# EAGLE design RPi-HAT_BUS-Controller_V0.7 (EAGLE 6.5.0)
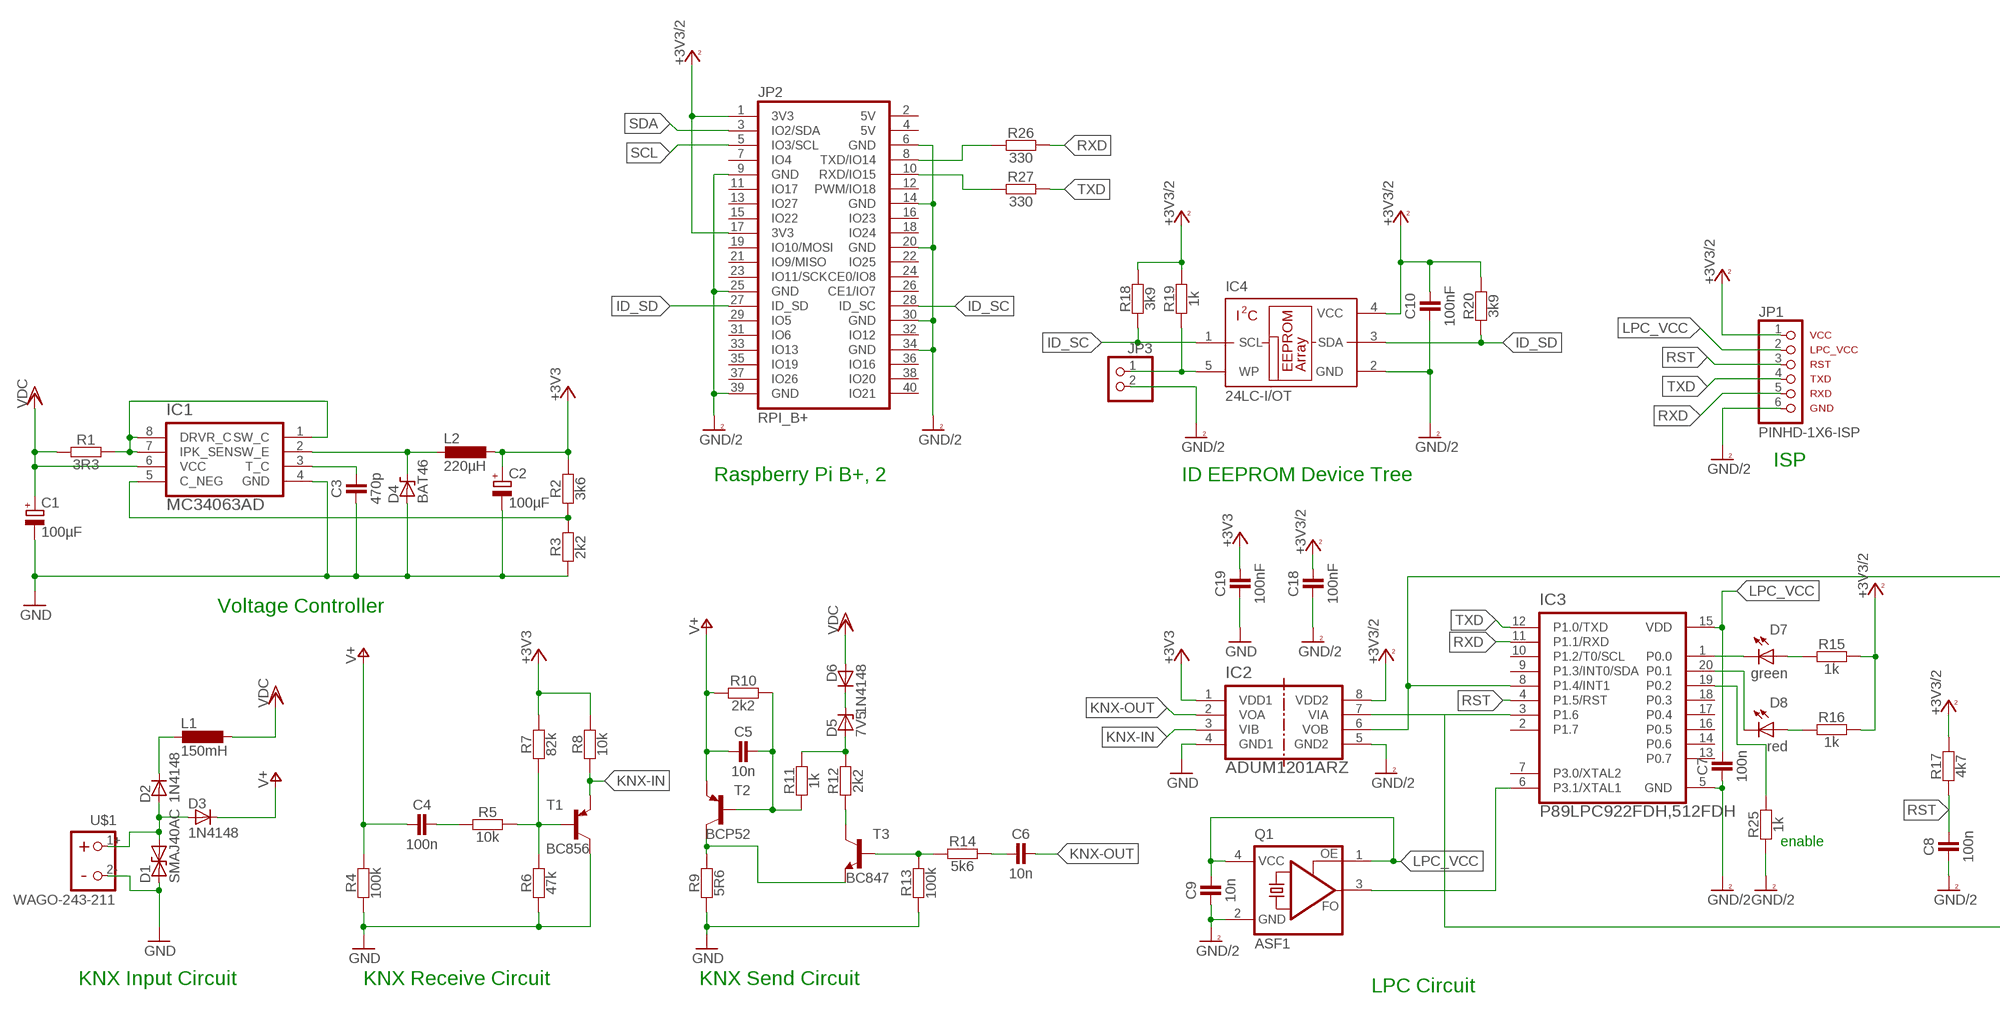
[diagram p0: schematic, sheet 1, part 1 of 2]
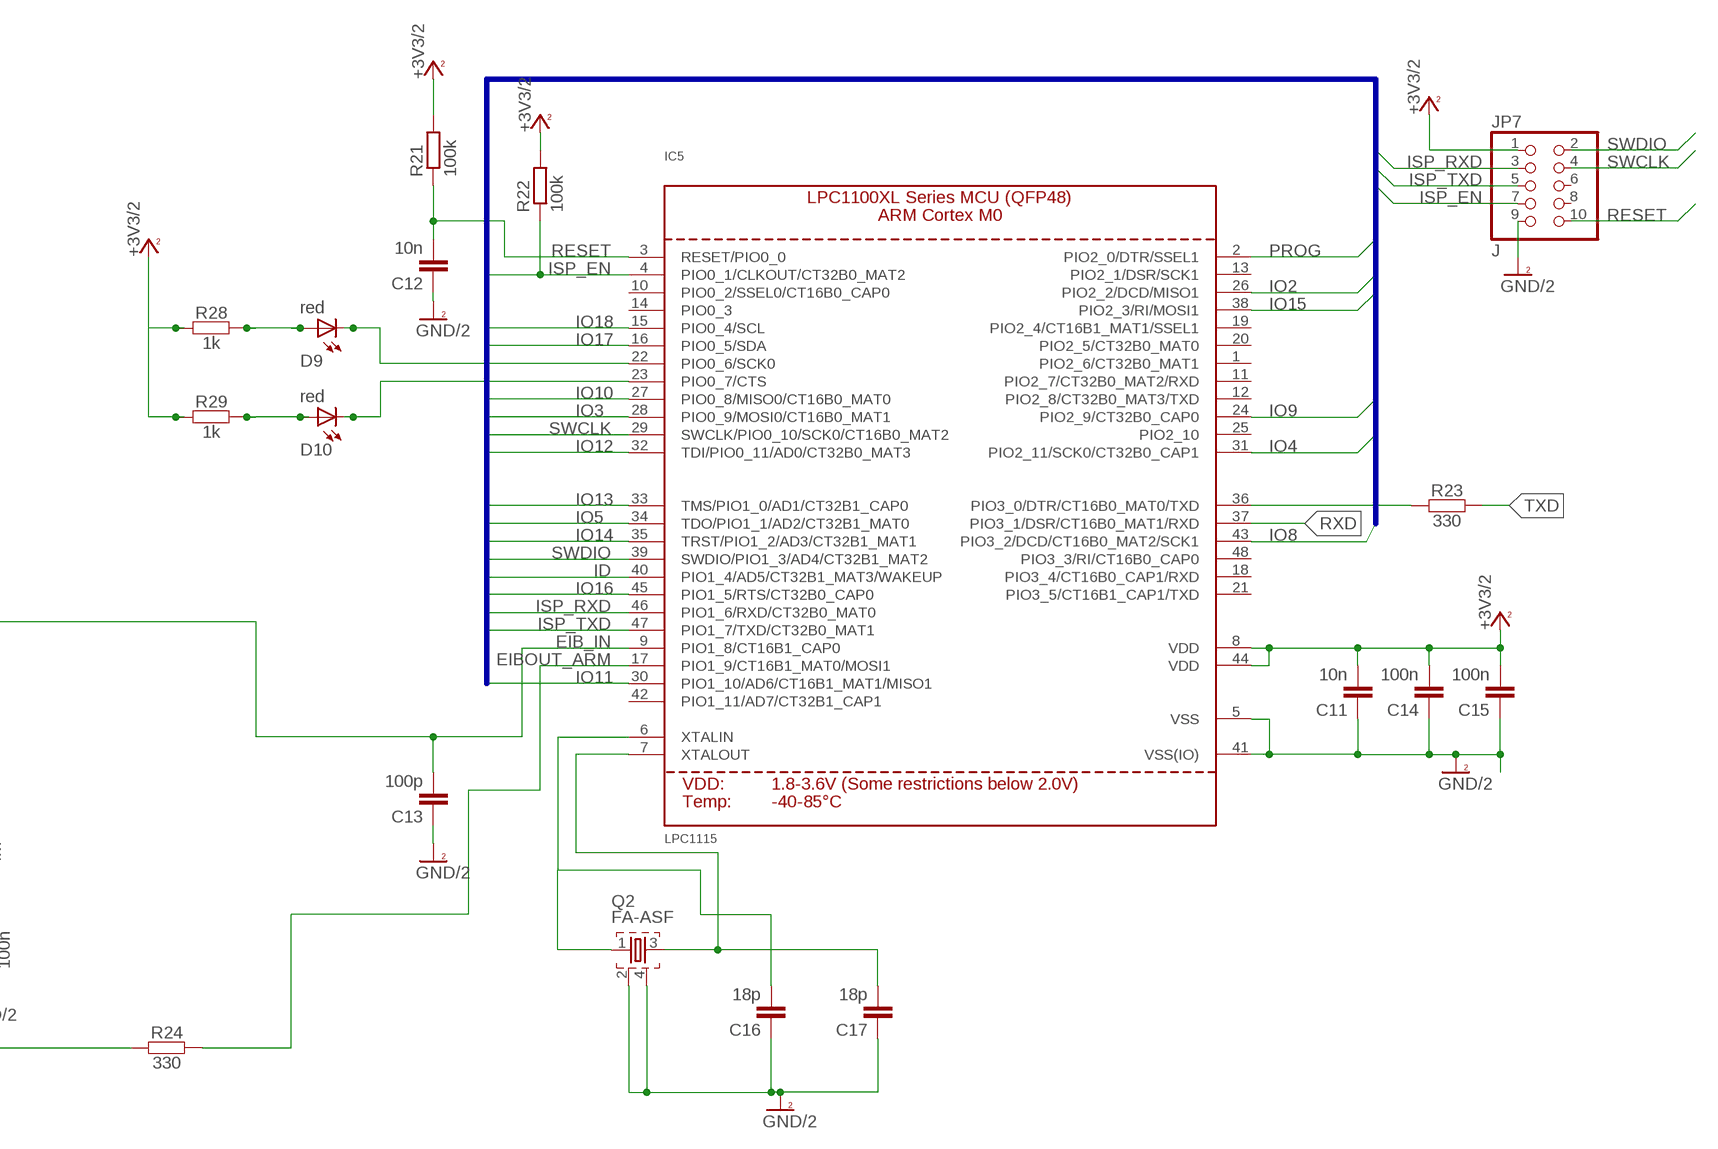
[diagram p1: schematic, sheet 1, part 2 of 2]

## Parts
C1  100µF  100µF,35V  [PANASONIC_D]
C2  100µF  100µF,6.3V  [PANASONIC_C]
C3  470p  CAPACITORC1206  [R1206]
C4  100n  CAPACITORC1206  [R1206]
C5  10n  CAPACITORC1206  [R1206]
C6  10n  CAPACITORC1206  [R1206]
C7  100n  CAPACITORC1206  [R1206]
C8  100n  CAPACITORC1206  [R1206]
C9  10n  CAPACITORC1206  [R1206]
C10  100nF  CAPACITORC1206  [R1206]
C11  10n  C-EUC1206  [C1206]
C12  10n  C-EUC1206  [C1206]
C13  100p  C-EUC1206  [C1206]
C14  100n  C-EUC1206  [C1206]
C15  100n  C-EUC1206  [C1206]
C16  18p  C-EUC1206  [C1206]
C17  18p  C-EUC1206  [C1206]
C18  100nF  CAPACITORC1206  [R1206]
C19  100nF  CAPACITORC1206  [R1206]
D1  SMAJ40AC  [DO-214AC]
D2  1N4148  1N4148MINIMELF  [MINIMELF]
D3  1N4148  1N4148MINIMELF  [MINIMELF]
D4  BAT46  [MINIMELF]
D5  7V5  Z-DIODE  [MINIMELF]
D6  1N4148  1N4148MINIMELF  [MINIMELF]
D7  green  LED1206  [CHIPLED_1206]
D8  red  LED1206  [CHIPLED_1206]
D9  red  LED1206  [CHIPLED_1206]
D10  red  LED1206  [CHIPLED_1206]
IC1  MC34063AD  [SOIC127P600X175-8N]
IC2  ADUM1201ARZ  [SOIC127P600X175-8N]
IC3  P89LPC922FDH,512FDH  [SOP65P640X110-20N]
IC4  24LC-I/OT  [SOT23-5]
IC5  LPC1115  LPC1113/4/5_QFP48_XLSERIES  [LQFP48]
JP1  PINHD-1X6-ISP  [1X06]
JP2  RPI_B+  [RPI-B+HAT]
JP3  PINHD-1X2  [1X02]
JP7  J  PINHD-2X05_2.00  [2X05M]
L1  150mH  150MH-L11PL1  [11P-L1]
L2  220µH  220µH-SMCC11.43  [2200-11.43]
Q1  ASF1  [ASF]
Q2  FA-ASF  [ASF]
R1  3R3  RESISTORR1206  [R1206]
R2  3k6  RESISTORR1206  [R1206]
R3  2k2  RESISTORR1206  [R1206]
R4  100k  RESISTORR1206  [R1206]
R5  10k  RESISTORR1206  [R1206]
R6  47k  RESISTORR1206  [R1206]
R7  82k  RESISTORR1206  [R1206]
R8  10k  RESISTORR1206  [R1206]
R9  5R6  RESISTORR1206  [R1206]
R10  2k2  RESISTORR1206  [R1206]
R11  1k  RESISTORR1206  [R1206]
R12  2k2  RESISTORR1206  [R1206]
R13  100k  RESISTORR1206  [R1206]
R14  5k6  RESISTORR1206  [R1206]
R15  1k  RESISTORR1206  [R1206]
R16  1k  RESISTORR1206  [R1206]
R17  4k7  RESISTORR1206  [R1206]
R18  3k9  RESISTORR1206  [R1206]
R19  1k  RESISTORR1206  [R1206]
R20  3k9  RESISTORR1206  [R1206]
R21  100k  R-EU_R1206  [R1206]
R22  100k  R-EU_R1206  [R1206]
R23  330  RESISTORR1206  [R1206]
R24  330  RESISTORR1206  [R1206]
R25  1k  RESISTORR1206  [R1206]
R26  330  RESISTORR1206  [R1206]
R27  330  RESISTORR1206  [R1206]
R28  1k  RESISTORR1206  [R1206]
R29  1k  RESISTORR1206  [R1206]
T1  BC856  PNPBC856  [SOT23]
T2  BCP52  PNPBCP52  [SOT223]
T3  BC847  NPN-BC847  [SOT23]
U$1  WAGO-243-211  [WAGO-243-211]

## Nets
+3V3: C2.+ C19.2 IC2.1(VDD1) L2.1 R2.2 R7.2 R8.2
+3V3/2: C10.2 C11.2 C14.2 C15.2 C18.2 IC2.8(VDD2) IC4.4(VCC) IC5.8(VDD) IC5.44(VDD) JP1.1 JP2.1(3V3) JP2.17(3V3) JP7.1 R15.2 R16.2 R17.2 R18.2 R19.2 R20.2 R21.2 R22.2 R28.1 R29.1
EIB_IN: C13.2 IC2.6(VOB) IC3.8(P1.4/INT1) IC5.9(PIO1_8/CT16B1_CAP0)
EIB_OUT: IC2.7(VIA) IC3.3(P1.6) R24.1
EIBOUT_ARM: IC5.17(PIO1_9/CT16B1_MAT0/MOSI1) R24.2
GND: C1.- C2.- C3.1 C19.1 D1.A D4.A IC1.4(GND) IC2.4(GND1) R3.1 R4.1 R6.1 R9.1 R13.1 T1.3(C) U$1.2-
GND/2: C7.1 C8.1 C9.1 C10.1 C11.1 C12.1 C13.1 C14.1 C15.1 C16.1 C17.1 C18.1 IC2.5(GND2) IC3.5(GND) IC4.2(GND) IC5.5(VSS) IC5.41(VSS(IO)) JP1.6 JP2.6(GND) JP2.9(GND) JP2.14(GND) JP2.20(GND) JP2.25(GND) JP2.30(GND) JP2.34(GND) JP2.39(GND) JP3.2 JP7.9 Q1.2(GND) Q2.2 Q2.4 R25.1
ID: IC5.40(PIO1_4/AD5/CT32B1_MAT3/WAKEUP)
ID_SC: IC4.1(SCL) JP2.28(ID_SC) R18.1
ID_SD: IC4.3(SDA) JP2.27(ID_SD) R20.1
IO2: IC5.26(PIO2_2/DCD/MISO1)
IO3: IC5.28(PIO0_9/MOSI0/CT16B0_MAT1)
IO4: IC5.31(PIO2_11/SCK0/CT32B0_CAP1)
IO5: IC5.34(TDO/PIO1_1/AD2/CT32B1_MAT0)
IO8: IC5.43(PIO3_2/DCD/CT16B0_MAT2/SCK1)
IO9: IC5.24(PIO2_9/CT32B0_CAP0)
IO10: IC5.27(PIO0_8/MISO0/CT16B0_MAT0)
IO11: IC5.30(PIO1_10/AD6/CT16B1_MAT1/MISO1)
IO12: IC5.32(TDI/PIO0_11/AD0/CT32B0_MAT3)
IO13: IC5.33(TMS/PIO1_0/AD1/CT32B1_CAP0)
IO14: IC5.35(TRST/PIO1_2/AD3/CT32B1_MAT1)
IO15: IC5.38(PIO2_3/RI/MOSI1)
IO16: IC5.45(PIO1_5/RTS/CT32B0_CAP0)
IO17: IC5.16(PIO0_5/SDA)
IO18: IC5.15(PIO0_4/SCL)
ISP_EN: IC5.4(PIO0_1/CLKOUT/CT32B0_MAT2) JP7.7 R22.1
ISP_RXD: IC5.46(PIO1_6/RXD/CT32B0_MAT0) JP7.3
ISP_TXD: IC5.47(PIO1_7/TXD/CT32B0_MAT1) JP7.5
KNX-IN: IC2.3(VIB) R8.1 T1.2(E)
KNX-OUT: C6.2 IC2.2(VOA)
LPC_VCC: C7.2 C9.2 IC3.15(VDD) JP1.2 Q1.1(OE) Q1.4(VCC)
N$1: D1.C D2.A D3.A U$1.1+
N$2: C16.2 IC5.6(XTALIN) Q2.1
N$3: IC1.5(C_NEG) R2.1 R3.2
N$4: C4.2 R5.1
N$5: D2.C L1.2
N$6: R5.2 R6.2 R7.1 T1.1(B)
N$7: C17.2 IC5.7(XTALOUT) Q2.3
N$8: IC1.1(SW_C) IC1.7(IPK_SEN) IC1.8(DRVR_C) R1.2
N$9: D8.C IC3.20(P0.1)
N$10: C3.2 IC1.3(T_C)
N$11: D7.C IC3.1(P0.0)
N$12: IC4.5(WP) JP3.1 R19.1
N$13: D4.C IC1.2(SW_E) L2.2
N$14: IC3.19(P0.2) R25.2
N$15: D10.A R29.2
N$16: D9.A R28.2
N$17: JP2.8(TXD/IO14) R26.1
N$18: JP2.10(RXD/IO15) R27.1
N$19: D10.C IC5.23(PIO0_7/CTS)
N$20: D9.C IC5.22(PIO0_6/SCK0)
N$23: R9.2 T2.2(C) T2.4(C) T3.2(E)
N$24: C5.2 R10.2 R11.1 T2.1(B)
N$25: D5.A R11.2 R12.2
N$26: R12.1 T3.3(C)
N$28: R13.2 R14.1 T3.1(B)
N$29: C6.1 R14.2
N$31: D5.C D6.C
N$32: IC3.6(P3.1/XTAL1) Q1.3(FO)
N$35: D7.A R15.1
N$38: D8.A R16.1
PROG: IC5.2(PIO2_0/DTR/SSEL1)
RESET: C12.2 IC5.3(RESET/PIO0_0) JP7.10 R21.1
RST: C8.2 IC3.4(P1.5/RST) JP1.3 R17.1
RXD: IC3.11(P1.1/RXD) IC5.37(PIO3_1/DSR/CT16B0_MAT1/RXD) JP1.5 R26.2
SCL: JP2.5(IO3/SCL)
SDA: JP2.3(IO2/SDA)
SWCLK: IC5.29(SWCLK/PIO0_10/SCK0/CT16B0_MAT2) JP7.4
SWDIO: IC5.39(SWDIO/PIO1_3/AD4/CT32B1_MAT2) JP7.2
TXD: IC3.12(P1.0/TXD) JP1.4 R23.2 R27.2
TXD_ARM: IC5.36(PIO3_0/DTR/CT16B0_MAT0/TXD) R23.1
V+: C4.1 C5.1 D3.C R4.2 R10.1 T2.3(E)
VDD: C1.+ D6.A IC1.6(VCC) L1.1 R1.1 ; supply symbol labelled VDC
Unconnected: IC3.2(P1.7) IC3.7(P3.0/XTAL2) IC3.9(P1.3/INT0/SDA) IC3.10(P1.2/T0/SCL) IC3.13(P0.7) IC3.14(P0.6) IC3.16(P0.5) IC3.17(P0.4) IC3.18(P0.3) IC5.1(PIO2_6/CT32B0_MAT1) IC5.10(PIO0_2/SSEL0/CT16B0_CAP0) IC5.11(PIO2_7/CT32B0_MAT2/RXD) IC5.12(PIO2_8/CT32B0_MAT3/TXD) IC5.13(PIO2_1/DSR/SCK1) IC5.14(PIO0_3) IC5.18(PIO3_4/CT16B0_CAP1/RXD) IC5.19(PIO2_4/CT16B1_MAT1/SSEL1) IC5.20(PIO2_5/CT32B0_MAT0) IC5.21(PIO3_5/CT16B1_CAP1/TXD) IC5.25(PIO2_10) IC5.42(PIO1_11/AD7/CT32B1_CAP1) IC5.48(PIO3_3/RI/CT16B0_CAP0) JP2.2(5V) JP2.4(5V) JP2.7(IO4) JP2.11(IO17) JP2.12(PWM/IO18) JP2.13(IO27) JP2.15(IO22) JP2.16(IO23) JP2.18(IO24) JP2.19(IO10/MOSI) JP2.21(IO9/MISO) JP2.22(IO25) JP2.23(IO11/SCK) JP2.24(CE0/IO8) JP2.26(CE1/IO7) JP2.29(IO5) JP2.31(IO6) JP2.32(IO12) JP2.33(IO13) JP2.35(IO19) JP2.36(IO16) JP2.37(IO26) JP2.38(IO20) JP2.40(IO21) JP7.6 JP7.8

## Buses
IO[1..18],RESET,SWCLK,SWDIO,ISP_EN,PROG,ID,ISP_TXD,ISP_RXD

## Notes on the sheet
- ISP
- Raspberry Pi B+, 2 | ID EEPROM Device Tree
- Voltage Controller
- enable
- KNX Input Circuit | KNX Receive Circuit | KNX Send Circuit
- LPC Circuit

## Library data of the parts
C1 = RCL_for_Selfbus-Projects:100µF,35V: Polarized Capacitor 100µF, 35V
C2 = RCL_for_Selfbus-Projects:100µF,6.3V: Polarized Capacitor 100µF, 6.3V
C3-C10 C18 C19 = RCL_for_Selfbus-Projects:CAPACITOR: Capacitor
C11 C12 = rcl:C-EU: CAPACITOR, European symbol; REICHELT: X7R-G0805 10N
C13 = rcl:C-EU: CAPACITOR, European symbol; REICHELT: NPO-G0805 100P
C14 C15 = rcl:C-EU: CAPACITOR, European symbol; REICHELT: X7R-G0805 100N
C16 C17 = rcl:C-EU: CAPACITOR, European symbol
D1 = Diode:SMAJ40AC
D2 D3 = Diode:1N4148
D4 = Diode_for_Selfbus-Projects:BAT46: Schottky Diode
D5 = Diode_for_Selfbus-Projects:Z-DIODE: Z-Diode
D6 = Diode_for_Selfbus-Projects:1N4148: Diode
D7-D10 = Diode_for_Selfbus-Projects:LED: LED
IC1 = IC_for_Selfbus-Projects:MC34063A: DC/DC converter control circuit
IC2 = IC_for_Selfbus-Projects:ADUM1201ARZ: Dual-Channel Digital Isolators; MPN: ADUM1201ARZ; OC_FARNELL: 1078200; OC_NEWARK: 19M0753; PACKAGE: SOIC-8; SUPPLIER: Analog Devices
IC3 = IC_for_Selfbus-Projects:P89LPC922FDH,512: 8-bit microcontrollers with two-clock 80C51 core 2 kB/4 kB/8 kB 3 V low-power Flash with 256-byte data RAM; MPN: P89LPC922FDH,512; OC_FARNELL: 1895067; OC_NEWARK: 70R8570; PACKAGE: TSSOP-20; SUPPLIER: NXP
IC4 = IC_for_Selfbus-Projects:24LC*: Microchip I2C EEPROM 2 Kbit - 24LC02B - 24LC02BT-I/OTDKR-ND 32 Kbit- 24LC32A - 24LC32AT-I/OTDKR-ND; DIGIKEY: 24LC32AT-I/OTDKR-ND
IC5 = microbuilder:LPC1113/4/5_QFP48_XLSERIES: LPC1113/4/5 ARM Cortex M0 MCU (50MHz) - XL Series (FBD48/3x3) LPC1115FBD48/303: Max Frequency: 50MHz Flash: 64kB SRAM: 8kB ADC: 10-bit
JP1 = Connector_for_Selfbus-Projects:PINHD-1X6-ISP: PIN HEADER - ISP for Selfbus-Controller
JP2 = Connector_for_Selfbus-Projects:RPI_B+: RPi-B+ und RPi-B2 HAT
JP3 = Connector_for_Selfbus-Projects:PINHD-1X2: PIN HEADER
JP7 = pinhead-2:PINHD-2X05: PIN HEADER; REICHELT: MPE 150-3-010
L1 = RCL_for_Selfbus-Projects:150MH-L11P: Inductor 150mH
L2 = RCL_for_Selfbus-Projects:220µH-SMCC: Inductor 220µH
Q1 = IC_for_Selfbus-Projects:ASF*: CRYSTAL CLOCK OSCILLATORS 5.0 Vdc or 3.3 Vdc - LOW PROFILE ULTRA MINIATURE CERAMIC SURFACE MOUNT Source: http://www.abracon.com/Oscillators/asf1-L-L1.pdf; OC_FARNELL: unknown; OC_NEWARK: unknown
Q2 = crystal:FA-: MHz RANGE CRYSTAL UNIT Source: Epson Toyocom
R1-R20 R23-R29 = RCL_for_Selfbus-Projects:RESISTOR: Resistor
R21 R22 = rcl:R-EU_: RESISTOR, European symbol; REICHELT: SMD-0805 100K
T1 T2 = Transistor_for_Selfbus-Projects:PNP: PNP Transistor
T3 = Transistor_for_Selfbus-Projects:NPN: NPN Transistor
U$1 = Connector_for_Selfbus-Projects:WAGO-243-211: WAGO KNX-Busklemme

## Board
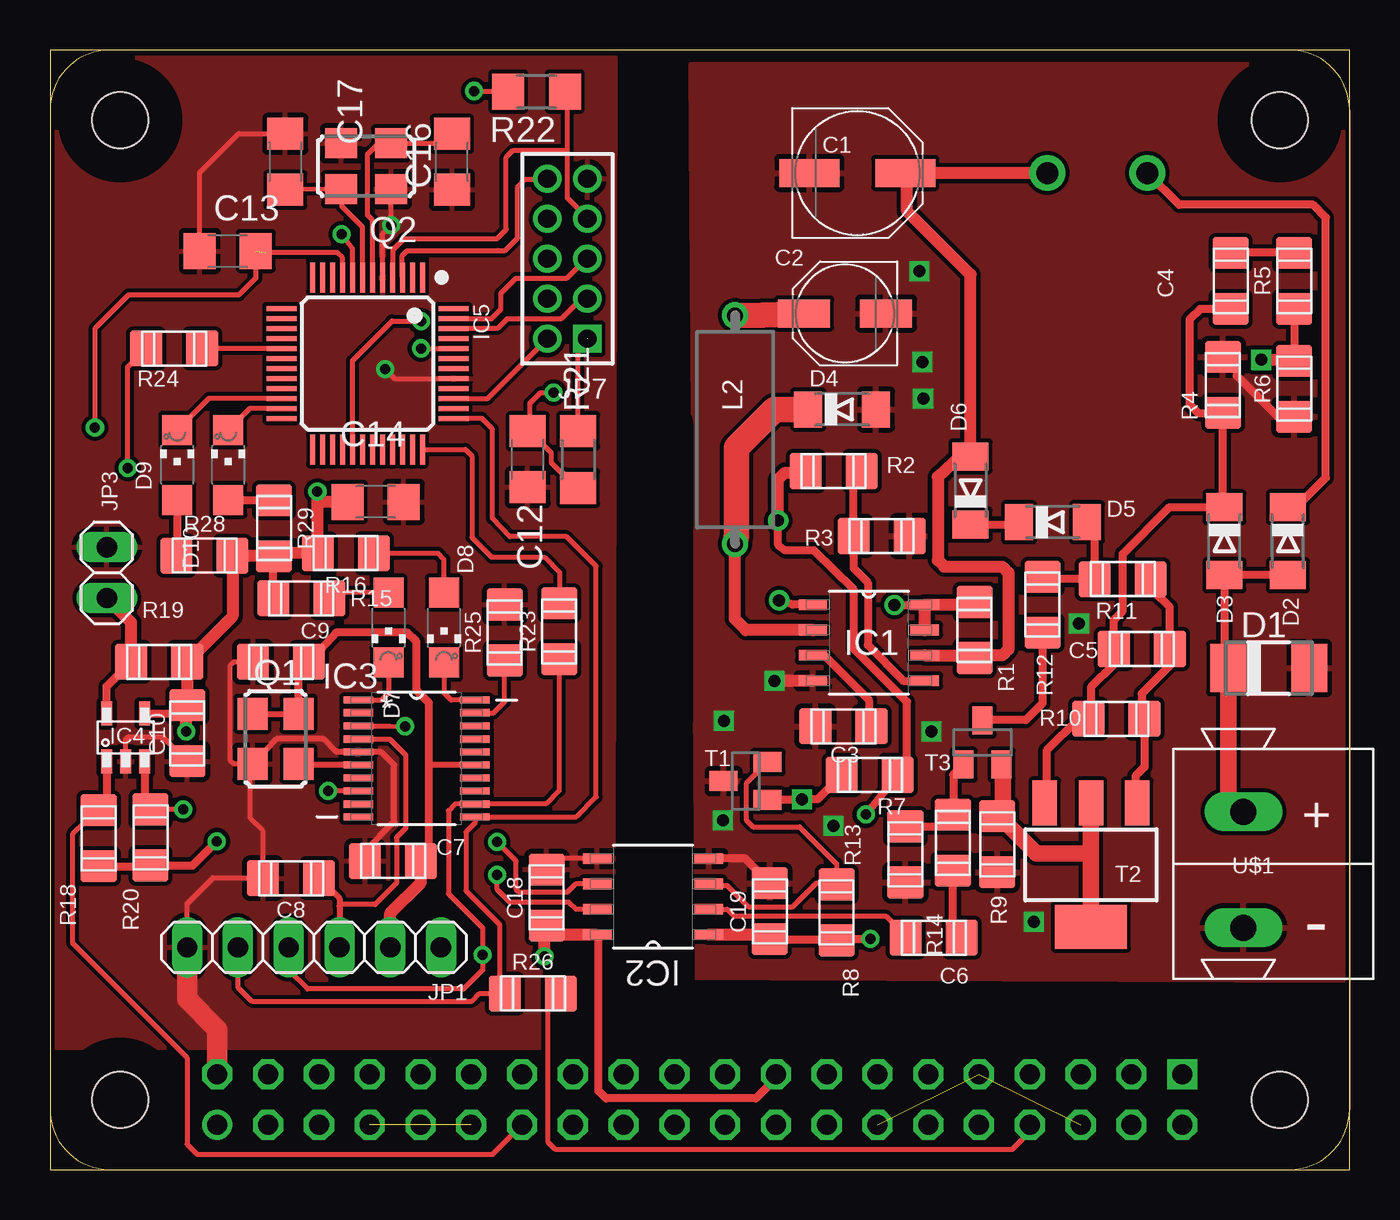
[diagram p2: board, top side]
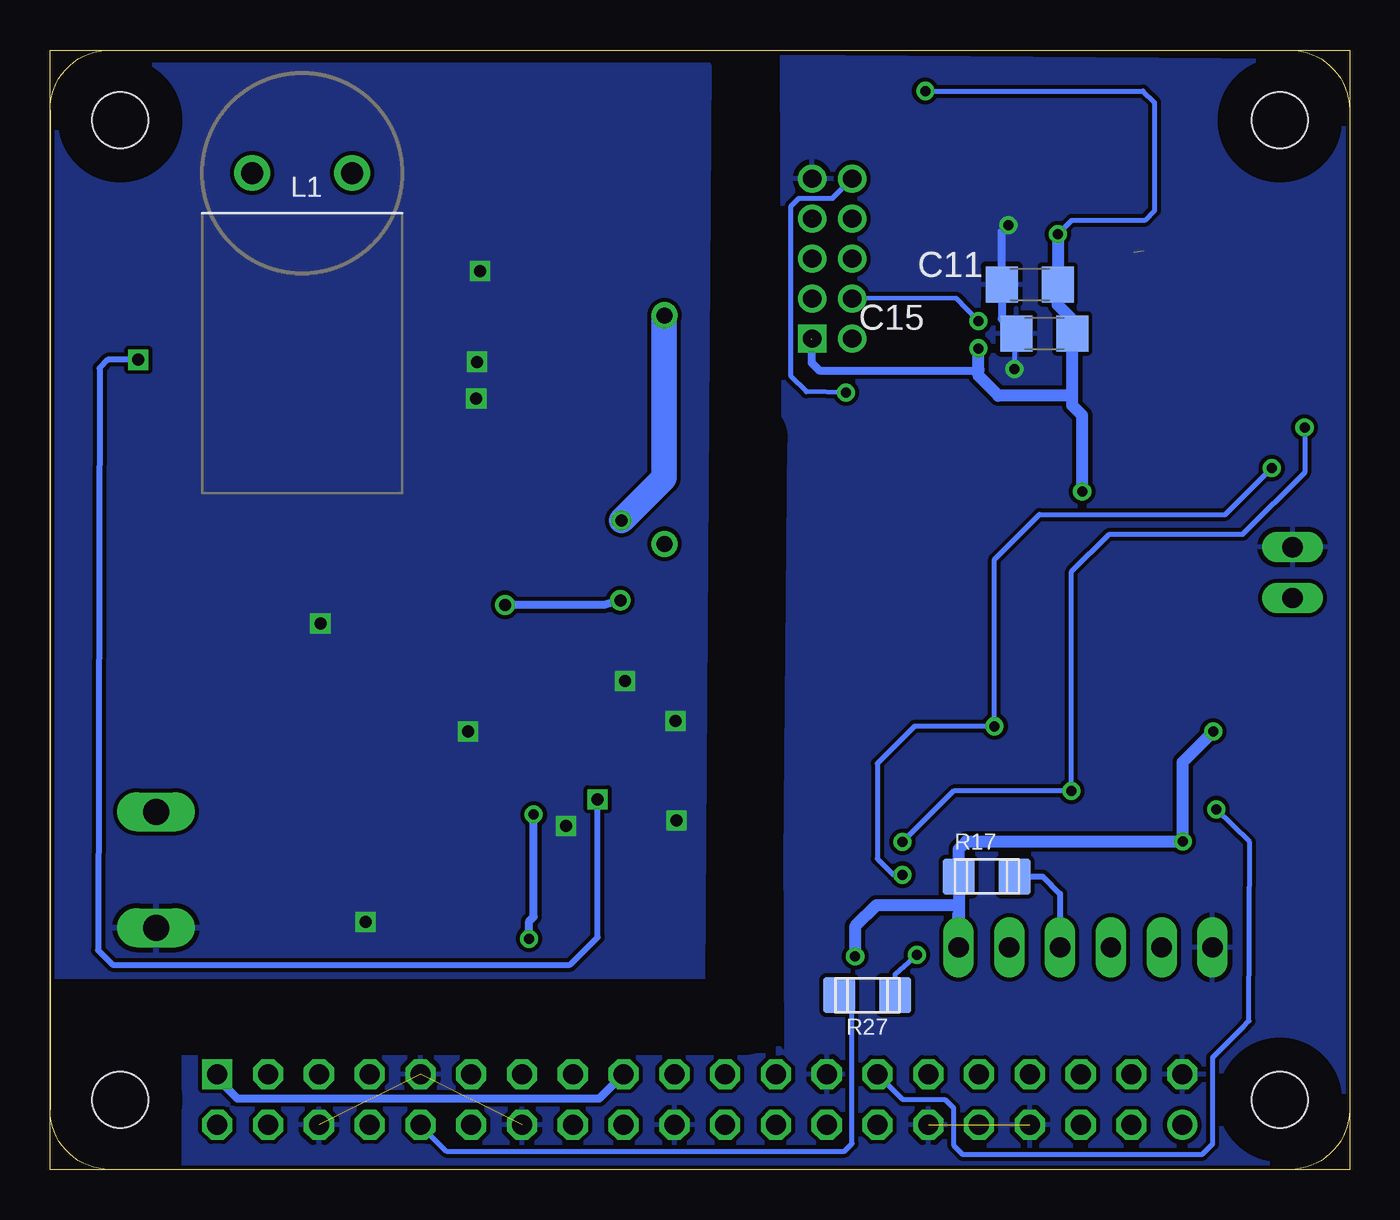
[diagram p3: board, bottom side, seen from below]

Size 65 x 56 mm. Coordinates in mm from the lower left corner, seen from the top.
Outline: 0,0 65,0 65,56 0,56 0,0
Copper layers (1*16): Top 0.035mm / dielectric 1.5mm / Bottom 0.035mm
Design rules "default *": minimum track width 8mil, minimum drill 0.3mm, track to track 8mil, track to pad 8mil, pad to pad 8mil, via to via 8mil, smd to smd 1mil, copper to edge 8mil, drill to drill 8mil, minimum pad ring 10mil, minimum via ring 8mil, stop-mask expansion 4mil, vias tented up to drill 0mil, thermal gap 10mil
tRestrict: 2 lines
bRestrict: 2 lines

### Footprints (pad centres in the part's own frame; a part is rotated, then mirrored left to right if it is on the bottom)
PANASONIC_D = smd 3 x 1.4: + 2.4,0; - -2.4,0
PANASONIC_C = smd 2.6 x 1.4: + 2.05,0; - -2.05,0
R1206 = smd 1.8 x 1.6: 1 0,1.4; 2 0,-1.4
C1206 = smd 1.6 x 1.8: 1 -1.4,0; 2 1.4,0
DO-214AC = smd 1.8 x 2.4: A 2.025,0; C -2.025,0
MINIMELF = smd 1.4 x 1.8: A 1.7,0; C -1.7,0
CHIPLED_1206 = smd 1.5 x 1.5: A -1.75,0; C 1.75,0
SOIC127P600X175-8N = smd 1.422 x 0.533: 1 -2.794,1.27; 2 -2.794,0; 3 -2.794,-1.27; 4 -2.794,-2.54; 5 2.794,-2.54; 6 2.794,-1.27; 7 2.794,0; 8 2.794,1.27
SOP65P640X110-20N = smd 1.473 x 0.356: 1 -2.286,2.54; 2 -2.286,1.905; 3 -2.286,1.245; 4 -2.286,0.584; 5 -2.286,-0.051; 6 -2.286,-0.711; 7 -2.286,-1.346; 8 -2.286,-2.007; 9 -2.286,-2.667; 10 -2.286,-3.302; 11 3.556,-3.302; 12 3.556,-2.667; 13 3.556,-2.007; 14 3.556,-1.346; 15 3.556,-0.711; 16 3.556,-0.051; 17 3.556,0.584; 18 3.556,1.245; 19 3.556,1.905; 20 3.556,2.54
SOT23-5 = smd 1.2 x 0.6: 1 -1.2,0.95; 2 -1.2,0; 3 -1.2,-0.95; 4 1.2,-0.95; 5 1.2,0.95
LQFP48 = smd 1.5 x 0.25: 1 -4.3,2.75; 2 -4.3,2.25; 3 -4.3,1.75; 4 -4.3,1.25; 5 -4.3,0.75; 6 -4.3,0.25; 7 -4.3,-0.25; 8 -4.3,-0.75; 9 -4.3,-1.25; 10 -4.3,-1.75; 11 -4.3,-2.25; 12 -4.3,-2.75; 25 4.3,-2.75; 26 4.3,-2.25; 27 4.3,-1.75; 28 4.3,-1.25; 29 4.3,-0.75; 30 4.3,-0.25; 31 4.3,0.25; 32 4.3,0.75; 33 4.3,1.25; 34 4.3,1.75; 35 4.3,2.25; 36 4.3,2.75 | smd 0.25 x 1.5: 13 -2.75,-4.3; 14 -2.25,-4.3; 15 -1.75,-4.3; 16 -1.25,-4.3; 17 -0.75,-4.3; 18 -0.25,-4.3; 19 0.25,-4.3; 20 0.75,-4.3; 21 1.25,-4.3; 22 1.75,-4.3; 23 2.25,-4.3; 24 2.75,-4.3; 37 2.75,4.3; 38 2.25,4.3; 39 1.75,4.3; 40 1.25,4.3; 41 0.75,4.3; 42 0.25,4.3; 43 -0.25,4.3; 44 -0.75,4.3; 45 -1.25,4.3; 46 -1.75,4.3; 47 -2.25,4.3; 48 -2.75,4.3
1X06 = drill 1.016 long: 1 -6.35,0; 2 -3.81,0; 3 -1.27,0; 4 1.27,0; 5 3.81,0; 6 6.35,0
RPI-B+HAT = drill 1 square: 1 56.63,4.77 | drill 1 octagon: 2 56.63,2.23; 3 54.09,4.77; 4 54.09,2.23; 5 51.55,4.77; 6 51.55,2.23; 7 49.01,4.77; 8 49.01,2.23; 9 46.47,4.77; 10 46.47,2.23; 11 43.93,4.77; 12 43.93,2.23; 13 41.39,4.77; 14 41.39,2.23; 15 38.85,4.77; 16 38.85,2.23; 17 36.31,4.77; 18 36.31,2.23; 19 33.77,4.77; 20 33.77,2.23; 21 31.23,4.77; 22 31.23,2.23; 23 28.69,4.77; 24 28.69,2.23; 25 26.15,4.77; 26 26.15,2.23; 27 23.61,4.77; 28 23.61,2.23; 29 21.07,4.77; 30 21.07,2.23; 31 18.53,4.77; 32 18.53,2.23; 33 15.99,4.77; 34 15.99,2.23; 35 13.45,4.77; 36 13.45,2.23; 37 10.91,4.77; 38 10.91,2.23; 39 8.37,4.77 | drill 1: 40 8.37,2.23 | hole 2.8: 3.5,3.5; 3.5,52.5; 61.5,52.5; 61.5,3.5
1X02 = drill 1.016 long: 1 -1.27,0; 2 1.27,0
2X05M = drill 0.914 square: 1 -4,-1 | drill 0.914: 2 -4,1; 3 -2,-1; 4 -2,1; 5 0,-1; 6 0,1; 7 2,-1; 8 2,1; 9 4,-1; 10 4,1
11P-L1 = drill 1.1 pad 1.778: 1 -2.5,0; 2 2.5,0
2200-11.43 = drill 0.8 pad 1.27: 1 -5.715,0; 2 5.715,0
ASF = smd 1.6 x 1.5: 1 -1.25,-1.15; 2 1.25,-1.15; 3 1.25,1.15; 4 -1.25,1.15
R1206' = smd 1.6 x 1.803: 1 -1.422,0; 2 1.422,0
SOT23 = smd 1 x 1.4: 1 -0.95,-1.1; 2 0.95,-1.1; 3 0,1.1
SOT223 = smd 1.219 x 2.235: 1 -2.311,-3.099; 2 0,-3.099; 3 2.311,-3.099 | smd 3.6 x 2.2: 4 0,3.099
WAGO-243-211 = drill 1.3 long: 1+ 0,2.65; 2- 0,-3.15

### Placement (x,y rotation side)
C1  40.39,49.85 0 top
C2  39.76,42.81 180 top
C3  39.69,22.17 90 top
C4  59.05,44.45 180 top
C5  54.61,26.04 90 top
C6  44.21,11.6 270 top
C7  17.16,15.43 90 top
C8  12.06,14.57 90 top
C9  11.55,25.39 90 top
C10  6.87,21.82 180 top
C11  15.99,44.27 0 bottom
C12  23.9,35.53 90 top
C13  8.89,45.94 0 top
C14  16.3,33.39 180 top
C15  15.27,41.81 0 bottom
C16  20.1,50.41 90 top
C17  11.77,50.41 270 top
C18  24.84,13.6 0 top
C19  36,12.92 0 top
D1  60.96,25.08 0 top
D2  61.91,31.43 270 top
D3  58.74,31.43 270 top
D4  39.62,38.02 0 top
D5  50.16,32.38 0 top
D6  46.04,33.97 90 top
D7  16.93,27.1 270 top
D8  19.71,27.11 270 top
D9  6.36,35.24 90 top
D10  8.92,35.24 90 top
IC1  40.96,26.99 0 top
IC2  30.16,13.02 180 top
IC3  17.7,20.94 0 top
IC4  3.78,21.62 90 top
IC5  15.88,40.32 270 top
JP1  13.21,11.11 180 top
JP2  0,0 0 top
JP3  2.84,29.86 90 top
JP7  25.88,45.56 90 top
L1  52.39,49.85 180 bottom
L2  34.26,37.01 270 top
Q1  11.29,21.55 270 top
Q2  15.81,50.18 180 top
R1  46.24,26.99 180 top
R2  39.19,34.94 270 top
R3  41.59,31.69 270 top
R4  58.67,39.24 0 top
R5  62.23,44.45 0 top
R6  62.23,39.05 180 top
R7  41.01,19.74 90 top
R8  39.34,12.87 0 top
R9  47.38,16.27 180 top
R10  53.34,22.54 90 top
R11  53.66,29.53 270 top
R12  49.64,28.26 180 top
R13  42.79,15.76 180 top
R14  45.16,16.34 0 top
R15  12.57,28.57 270 top
R16  14.8,30.83 270 top
R17  18.15,14.65 270 bottom
R18  2.44,16.57 0 top
R19  5.46,25.4 90 top
R20  5.03,16.61 0 top
R21  100k  [R1206']  26.42,35.52 90 top
R22  100k  [R1206']  24.34,53.92 180 top
R23  25.47,26.92 0 top
R24  6.21,41.07 90 top
R25  22.75,26.86 0 top
R26  24.16,8.8 270 top
R27  24.12,8.72 90 bottom
R28  7.73,30.71 270 top
R29  11.2,32.08 180 top
T1  34.8,19.43 90 top
T2  52.07,15.24 180 top
T3  46.65,21.36 0 top
U$1  59.69,15.24 0 top

### Tracks (layer width: path | path; a pad name or v marks a point on that pad's centre or on a via)
+3V3  (via drill 0.5, 0.6)
  Top 0.406: 42.42,19.73 R7.2 | R7.2 42.41,19.87 42.86,20.32 42.86,23.39 40.21,26.05 40.21,29.01 38.21,30.96 36.78,30.96 36.42,31.24 v36.42,32.46 | C19.2 39.29,11.52 | 39.29,11.52 R8.2 | 39.29,11.52 39.32,11.54 v41.03,11.54 | v40.8,17.75 42.37,19.66 R7.2
  Top 0.61: v36.42,32.46 36.42,34.52 36.77,34.86 37.72,34.86 R2.2 | C19.2 35.77,11.75 IC2.1
  Top 1.27: C2.+ 35.65,42.74 L2.1
  Bottom 0.406: v41.03,11.54 41.03,12.42 40.8,12.65 v40.8,17.75
  Bottom 1.27: v36.42,32.46 34.29,34.59 34.29,42.7 L2.1
+3V3/2  (via drill 0.5)  (1 unrouted)
  Top 0.254: IC5.8 15.12,46.06 v14.59,46.79 | R21.2 26.42,41.11 JP7.1 | 6.47,22.82 C10.2 | 4.99,15.17 R20.2 | 11.17,30.71 R29.1 | v18.55,41.08 IC5.44 | R22.2 21.29,53.92 v21.22,53.95
  Top 0.406: JP2.17 36.31,4.56 35.31,3.56 27.81,3.56 27.43,3.94 27.43,11.73 27.45,11.72 IC2.8 | 27.37,11.72 IC2.8 | IC2.8 27.36,11.73 | IC4.4 6.47,22.82 | R18.2 4.99,15.17 | R20.2 7.13,15.21 v8.34,16.42 | 11.17,30.71 10.71,30.71 10.82,30.83 | R15.2 11.17,30.65 R29.1
  Top 0.61: 27.36,11.73 25.18,11.73 24.72,12.2 C18.2 24.74,12.19 v24.73,10.67 | C10.2 R19.2 9.13,27.67 R28.1 10.71,30.71 | 10.82,30.83 R16.2 13.4,33.38 | 13.4,33.38 13.4,33.73 v13.37,33.91 | C14.2 13.41,33.39 13.4,33.38 | v6.82,21.91 6.82,23.17 C10.2
  Bottom 0.254: v21.22,53.95 10.32,53.95 9.75,53.38 9.75,47.97 10.25,47.47 13.91,47.47 v14.59,46.79 | C11.2
  Bottom 0.406: JP2.1 56.63,4.56 55.63,3.56 37.52,3.56 JP2.17 | 26.91,41.53 26.91,40.36 26.52,39.97 18.59,39.97 18.55,40.01
  Bottom 0.61: v14.59,46.79 C11.2 | JP1.1 19.56,11.73 | 19.56,11.73 19.56,12.81 | v24.73,10.67 24.73,12.15 23.66,13.22 19.59,13.22 19.55,13.18 | 19.55,13.18 R17.2 19.55,16.04 19.16,16.42 v8.34,16.42 8.34,20.38 v6.82,21.91 | 19.55,13.18 19.55,11.74 19.56,11.73 | v18.55,41.08 18.55,40.01 18.55,39.7 17.56,38.71 13.91,38.71 13.87,38.67 | v13.37,33.91 13.37,37.72 13.87,38.21 13.87,38.67 | 13.87,38.67 C15.2 13.87,42.52 14.59,43.24 C11.2 | C11.2
EIB_IN  (via drill 0.5)  (1 unrouted)
  Top 0.254: IC5.9 14.62,45.61 14.36,45.87 10.78,45.87 10.32,45.41 | IC2.6 26.29,14.29 25.87,13.87 23.47,13.87 23.32,14.02 23.32,15.43 v22.36,16.38 | IC3.8 v13.91,18.94 | C13.2 10.29,44.58 9.45,43.74 3.92,43.74 2.25,42.06 v2.25,37.11
  Bottom 0.254: v2.25,37.11 2.25,34.86 5.33,31.77 12,31.77 13.91,29.91 v13.91,18.94 19.81,18.94 v22.36,16.38
EIB_OUT  (via drill 0.5)
  Top 0.254: IC2.7 26.3,13.02 25.95,13.37 23.01,13.37 22.36,14.02 v22.36,14.74 | IC3.3 16.97,22.19 v17.75,22.17 | v3.89,35.09 3.89,40.15 R24.1
  Bottom 0.254: v22.36,14.74 22.82,14.74 23.62,15.54 23.62,20.31 21.75,22.17 v17.75,22.17 17.75,30.52 15.51,32.77 6.21,32.77 v3.89,35.09
EIBOUT_ARM
  Top 0.254: IC5.17 R24.2
GND  (via drill 0.6)
  Top 0.254: 33.01,15.51 IC2.4
  Top 0.406: R6.1 61.41,37.65 59.36,39.7 59.36,39.96 R4.1 | C19.1 34.76,15.56 IC2.4
  Top 0.61: IC1.4 36.35,24.45 v36.25,24.43
  other vias: 51.47,27.3 33.71,22.44 33.66,17.46 44.08,21.91 49.21,12.38 43.64,40.4 43.68,38.57 43.48,44.93 39.18,17.2
  pour Bottom: 32.38,9.53 65.02,9.53 65.02,9.65 64.71,55.24 32.07,55.24
  pour Top: 32.38,9.53 65.02,9.53 64.71,55.24 32.07,55.24
GND/2  (via drill 0.5)  (3 unrouted)
  Top 0.254: IC5.5 16.62,46.8 v17.07,47.24 17.07,48.96 Q2.4 | v16.76,40.04 17.23,39.57 IC5.41 | IC2.5 25.4,15.56 C18.1 | JP1.6 6.86,13.3 8.15,14.59 10.64,14.59 C8.1 10.66,16.93 10.02,17.56 10.02,20.22 Q1.2 | IC4.2 3.79,21.5 3.92,21.64 5.65,21.64 C10.1 | 10,20.19 Q1.2 | C13.1 7.49,49.86 9.45,51.82 C17.1 | 10.02,25.41 10.04,25.39 C9.1 9.2,25.39 8.99,25.18 8.99,20.5 9.18,20.31 10.12,20.31 Q1.2
  Top 0.305: C7.1 15.76,15.95 17.22,17.41 17.22,20.23 16.57,20.88 IC3.5 14.31,20.89 13.68,21.53 11.33,21.53 Q1.2
  Top 1.016: JP2.39 8.37,7.02 6.86,8.53 JP1.6
  Bottom 0.254: C15.1 16.75,41.74 v16.76,40.04
  Bottom 0.406: v17.07,47.24 17.39,46.92 C11.1 17.39,42.54 C15.1
  pour Bottom: 28.37,55.67 0.16,55.44 -0.11,27.52 0,0 58.29,0 58.29,5.71 28.57,5.71 28.57,6.1 28.13,5.62
  pour Top: 28.29,55.59 0.08,55.59 0.15,6.12 58.45,6.12 58.25,6.74 28.17,6.74
ID_SC
  Top 0.254: JP2.28 22.14,0.76 7.37,0.76 6.86,1.27 6.86,5.59 1.14,11.3 1.14,16.8 1.75,17.41 1.88,17.41 R18.1 2.83,18.37
  Top 0.406: IC4.1 2.83,18.37
ID_SD  (via drill 0.5)
  Top 0.254: v6.67,18.02 5.04,18.02 R20.1
  Top 0.406: IC4.3 4.74,18.31 R20.1
  Bottom 0.254: JP2.27 22.35,3.51 20.24,3.51 19.81,3.09 19.81,1.22 19.36,0.76 7.37,0.76 6.86,1.27 6.86,5.59 5.33,7.11 5.33,7.12 5.03,7.43 4.99,16.38 v6.67,18.02
ISP_EN  (1 unrouted)
  Top 0.254: IC5.4 17.14,44.64 17.14,46 17.7,46.55 22.36,46.55 22.82,47.02 22.82,50.63 23.16,50.98 25.84,50.98 25.88,50.94 | 26.88,47.58 25.88,48.58 25.88,50.94 | 25.88,50.94 25.88,53.8 R22.1
  Bottom 0.254: JP7.7 26.88,47.58
ISP_RXD
  Top 0.254: JP7.3 26.57,43.56 25.56,42.55 22.86,42.55 22.38,42.07 IC5.46
ISP_TXD
  Top 0.254: JP7.5 26.83,45.56 25.84,44.57 23.3,44.57 22.54,43.81 22.54,43.02 22.07,42.55 20.2,42.55 IC5.47
KNX-IN
  Top 0.254: IC2.3 33.45,14.29 33.53,14.21 33.87,14.21 34.94,13.14 37.15,13.14 38.33,14.33 39.25,14.33 R8.1 39.34,15.29 37.49,17.14 35.17,17.14 34.82,17.49 34.82,19.31 T1.2
KNX-OUT
  Top 0.254: IC2.2 33.88,13.02 34.21,12.69 41.81,12.69 42.94,11.56 C6.2
LPC_VCC
  Top 0.305: 12.44,25.37 C9.2 | Q1.1 Q1.4 | IC3.15 18.94,20.23
  Top 0.406: Q1.4 12.44,25.37 | C9.2 14.31,26.86 17.87,26.86 18.33,26.4 18.33,23.96 18.94,23.35 18.94,20.23 18.94,16.04 C7.2
  Top 0.61: JP1.2 17.02,12.83 18.55,14.36 18.55,15.66 C7.2
N$1
  Top 0.406: D2.A D3.A 58.74,25.28 D1.C
  Top 0.813: D1.C 58.94,18.64 U$1.1+
N$2
  Top 0.254: IC5.6 16.12,47.48 15.88,47.73 15.88,50.78 16.35,51.26 17.01,51.26 | Q2.1 20.57,51.33
  Top 0.406: 20.55,51.3 C16.2 20.57,51.33 | 17.01,51.26 17.01,51.27 Q2.1
N$3
  Top 0.406: IC1.5 42.69,24.45 40.91,26.23 40.91,29.36 40.19,30.08 R3.2 40.19,34.4 40.58,34.78 40.58,34.92 R2.1
N$4
  Top 0.406: R5.1 59.66,45.85 59.69,46.35 59.31,46.35 C4.2
N$5
  Top 0.406: D2.C 62.34,33.13 63.82,34.61 63.82,47.62 63.18,48.26 56.48,48.26 L1.2
N$6  (via drill 0.6)
  Top 0.305: R6.2 62.23,39.98
  Top 0.406: R5.2 R6.2 | R7.1 38.39,18.52 v37.6,18.52 36.5,18.52 36.46,18.48 T1.1
  Top 0.61: v60.58,40.5 62.18,40.5 R6.2
  Bottom 0.305: v60.58,40.5 62.1,40.5 62.52,40.08 62.6,10.97 61.87,10.25 38.98,10.25 37.6,11.62 v37.6,18.52
N$7
  Top 0.254: IC5.7 15.62,47.15 14.61,48.16 14.61,48.94 | Q2.3 C17.2
  Top 0.406: 14.61,48.94 14.61,48.98 Q2.3
N$8  (via drill 0.6)
  Top 0.406: 46.54,28.26 R1.2 | IC1.1 37.15,28.26 v36.47,28.47 | v42.24,28.25 43.5,28.25 IC1.8
  Top 0.61: 46.54,28.26 IC1.8 IC1.7
  Bottom 0.406: v36.47,28.47 37.29,28.25 v42.24,28.25
N$9
  Top 0.254: IC3.20 20.07,23.48 19.74,23.81 19.74,25.34 D8.C
N$10
  Top 0.406: IC1.3 38.73,25.72 40.96,23.5 40.96,22.04 C3.2
N$11
  Top 0.254: IC3.1 16.59,23.48 16.95,23.85 16.95,25.33 D7.C
N$12
  Top 0.406: IC4.5 2.83,24.17 R19.1
  Top 0.61: R19.1 4.06,27.37 JP3.1
N$13
  Top 0.61: IC1.2 34.81,26.99 34.25,27.55 34.25,30.62 L2.2
  Top 1.27: D4.C 36.23,38.02 34.33,36.12 34.33,31.74 L2.2
N$14
  Top 0.254: IC3.19 22.2,22.85 22.75,23.39 R25.2
N$15
  Top 0.254: 11.19,33.49 R29.2
  Top 0.406: D10.A 11.19,33.49
N$16
  Top 0.254: 6.36,30.74 R28.2
  Top 0.406: D9.A 6.36,30.74
N$17
  Top 0.254: JP2.8 49.01,1.88 48.12,0.99 25.3,0.99 24.92,1.37 24.92,8.71 R26.1
N$18
  Bottom 0.254: 46.47,2.2 45.19,0.91 25.26,0.91 24.88,1.29 24.88,8.75 R27.1
  Bottom 0.305: JP2.10 46.47,2.2
N$19
  Top 0.254: IC5.23 9.99,38.07 D10.C
N$20
  Top 0.254: IC5.22 7.94,38.57 D9.C
N$23
  Top 0.813: T2.2 52.07,15.73 | 52.07,15.73 T2.4 | 52.07,15.73 51.99,15.81 49.34,15.81 47.48,17.67 R9.2 47.38,17.7 47.66,17.98 47.66,20.2 T3.2
N$24
  Top 0.406: T2.1 54.29,18.43 54.29,19.68 54.74,20.13 R10.2 54.61,22.67 54.61,23.81 56.01,25.21 C5.2 56.01,28.13 55.24,28.89 55.24,29.34 R11.1
N$25
  Top 0.406: D5.A 52.26,31.99 R11.2 49.66,29.53 R12.2
N$26
  Top 0.406: R12.1 49.64,23.32 48.81,22.48 46.66,22.48 T3.3
N$28
  Top 0.406: R13.2 44.69,17.16 R14.1 45.19,17.77 45.19,19.75 T3.1
N$29
  Top 0.406: C6.1 45.16,11.63 R14.2
N$31
  Top 0.406: D6.C 48.35,32.27 D5.C
N$32
  Top 0.305: IC3.6 12.34,20.23 Q1.3
N$35
  Top 0.254: D7.A 14.26,28.86 R15.1
N$38
  Top 0.254: R16.1 19.39,30.83 19.7,30.52 19.7,28.87 D8.A
RESET  (via drill 0.5)
  Top 0.254: IC5.3 17.62,45.72 17.86,45.96 21.59,45.96 22.43,45.96 22.76,45.96 23.39,46.6 23.39,49.15 23.77,49.53 24.84,49.53 JP7.10 | v25.18,38.86 24.54,38.86 24,38.32 24,37.03 | 24,37.03 C12.2 | 24,37.03 24,36.92 25.07,35.85 25.07,35.36 25.6,34.82 25.69,34.82 R21.1
  Bottom 0.254: v25.18,38.86 27.16,38.9 27.93,39.66 27.93,48.2 27.55,48.58 25.86,48.58 JP7.10
RST
  Top 0.254: IC3.4 16.99,21.53 17.79,20.73 17.79,17.07 17.34,16.61 17.34,14.33 16.27,13.26 14.55,13.26 14.48,13.18
  Top 0.305: C8.2 14.48,13.55 14.48,13.18 JP1.3
  Bottom 0.305: R17.1 15.34,14.65 14.48,13.79 JP1.3
RXD
  Top 0.254: JP1.5 9.4,9.12 10.1,8.42 21.11,8.42 21.49,8.8 R26.2 22.48,8.81 22.48,12.27 20.8,13.95 20.8,16.88 21.26,17.34 IC3.11 26.33,17.64 27.32,18.63 27.32,30.18 25.83,31.66 23.01,31.66 22.14,32.58 22.14,37.03 21.6,37.57 IC5.37
SWCLK  (via drill 0.5)
  Top 0.254: IC5.29 15.12,40.46 17.11,42.44 v18.55,42.44
  Bottom 0.254: v18.55,42.44 19.67,43.59 JP7.4
SWDIO
  Top 0.254: IC5.39 21.89,38.57 JP7.2
TXD  (via drill 0.5)
  Top 0.254: JP1.4 11.96,11.09 11.96,9.94 12.88,9.03 20.69,9.03 21.64,9.98 v21.64,10.74 21.64,12.08 19.93,13.79 19.93,17.95 20.26,18.27 IC3.12 21.27,18.29 24.8,18.29 25.47,18.96 R23.2
  Bottom 0.254: R27.2 22.72,9.78 v21.64,10.74
TXD_ARM
  Top 0.254: IC5.36 20.79,36.02 21.11,35.7 21.11,31.62 22.1,30.63 24.73,30.63 25.49,29.87 25.49,28.34 R23.1
V+
  Top 0.406: T2.3 49.85,18.43 49.85,20.95 51.44,22.54 R10.1 52.07,22.67 52.07,24.13 53.21,25.27 C5.1 53.21,27.49 53.66,27.94 53.66,30.8 55.99,33.13 D3.C 58.67,33.2 R4.2 57.45,37.84 57,38.29 57,42.52 57.53,43.05 C4.1
VDD
  Top 0.406: 44.13,49.85 43.81,50.16 43.1,50.16 C1.+ 42.86,49.77 | 46.54,25.72 R1.1 46.8,25.72 | D6.A 45.52,35.67
  Top 0.61: L1.1 44.13,49.85 | IC1.6 46.54,25.72 | D6.A 46.04,44.77 42.86,47.94 42.86,49.77 | 45.52,35.67 44.41,34.65 44.41,30.48 44.73,30.16 47.62,30.16 47.94,29.84 47.94,26.04 47.62,25.72 46.8,25.72